# EAGLE design sub (EAGLE 7.7.0)
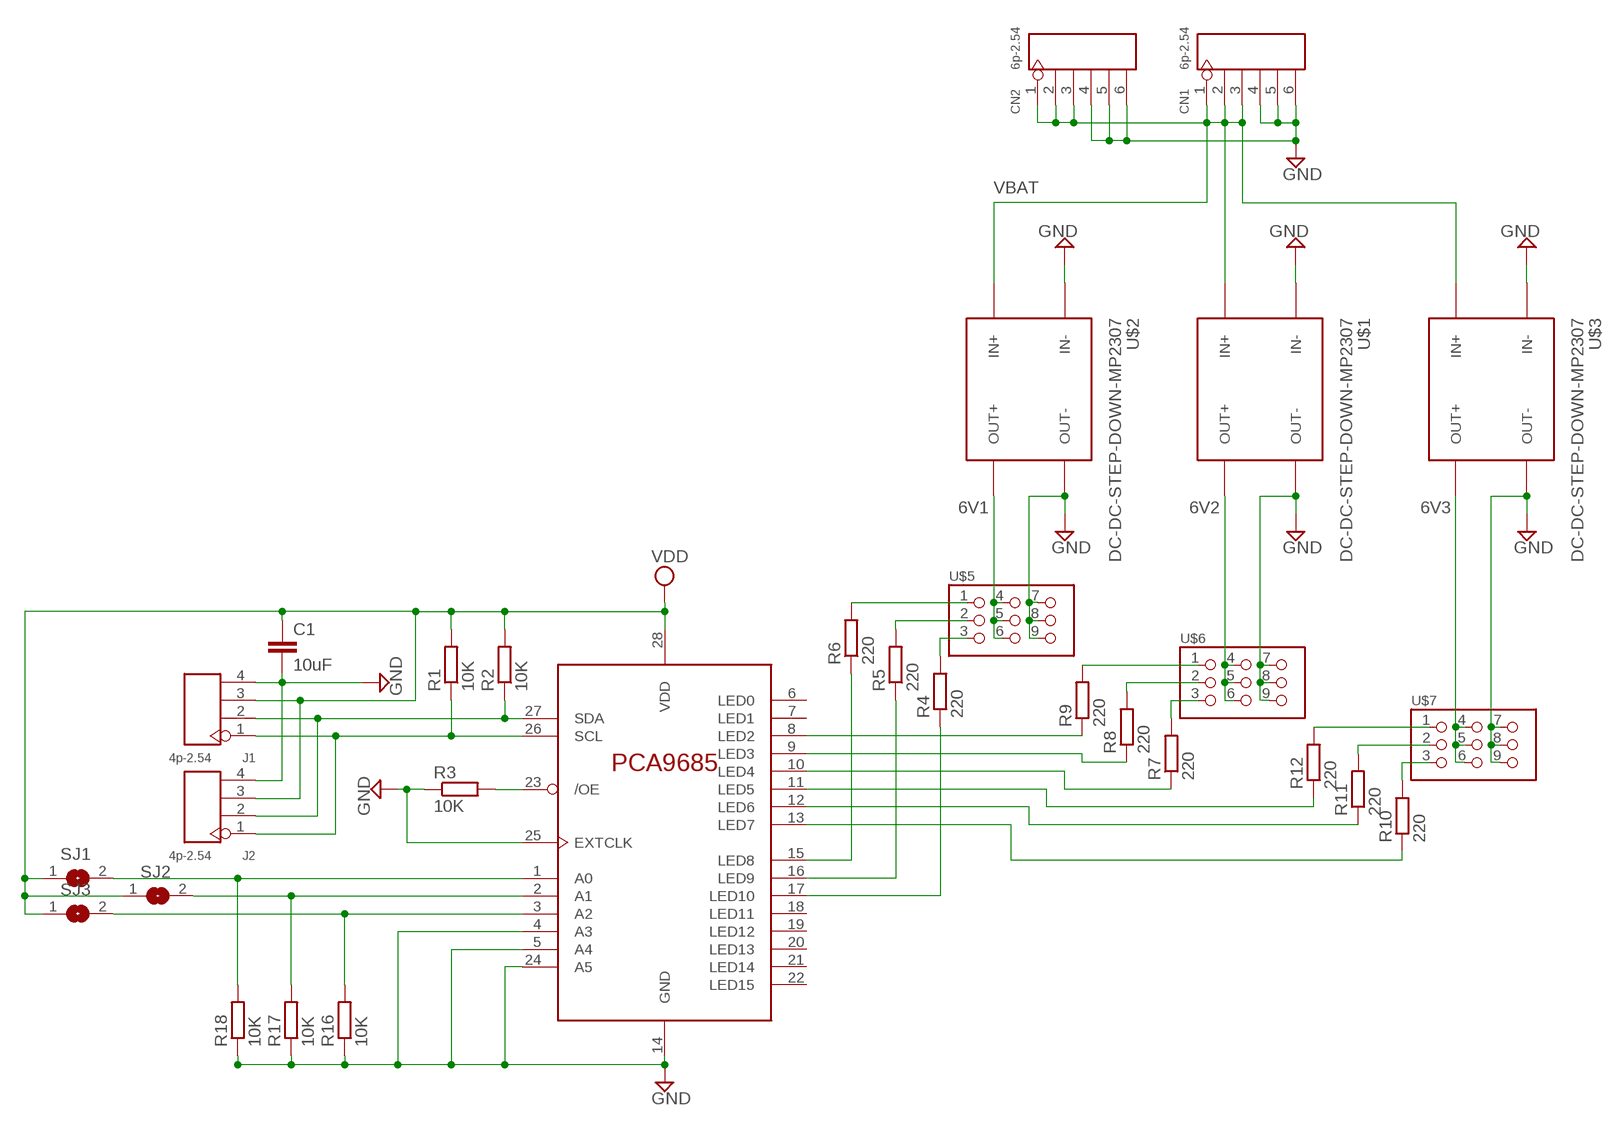
[diagram p0: schematic, sheet 1]

## Parts
C1  10uF  C-EUC0805  [C0805]
CN1  6p-2.54  DIP-BLACK-FEMALE-HEADER-VERT(6P-2.54)  [H6-2.54]
CN2  6p-2.54  DIP-BLACK-FEMALE-HEADER-VERT(6P-2.54)  [H6-2.54]
J1  4p-2.54  DIP-BLACK-FEMALE-HEADER-VERT(4P-2.54)  [H4-2.54]
J2  4p-2.54  DIP-BLACK-FEMALE-HEADER-VERT(4P-2.54)  [H4-2.54]
R1  10K  R-EU_M0805  [M0805]
R2  10K  R-EU_M0805  [M0805]
R3  10K  R-EU_M0805  [M0805]
R4  220  R-EU_M0805  [M0805]
R5  220  R-EU_M0805  [M0805]
R6  220  R-EU_M0805  [M0805]
R7  220  R-EU_M0805  [M0805]
R8  220  R-EU_M0805  [M0805]
R9  220  R-EU_M0805  [M0805]
R10  220  R-EU_M0805  [M0805]
R11  220  R-EU_M0805  [M0805]
R12  220  R-EU_M0805  [M0805]
R16  10K  R-EU_M0805  [M0805]
R17  10K  R-EU_M0805  [M0805]
R18  10K  R-EU_M0805  [M0805]
SJ1  SJ  [SJ]
SJ2  SJ  [SJ]
SJ3  SJ  [SJ]
U$1  DC-DC-STEP-DOWN-MP2307  [DC-DC-STEP-DOWN-MP2307]
U$2  DC-DC-STEP-DOWN-MP2307  [DC-DC-STEP-DOWN-MP2307]
U$3  DC-DC-STEP-DOWN-MP2307  [DC-DC-STEP-DOWN-MP2307]
U$4  PCA9685PW  [TSSOP28]
U$5  PIN_3X3  [PIN_3X3]
U$6  PIN_3X3  [PIN_3X3]
U$7  PIN_3X3  [PIN_3X3]

## Nets
6V1 [6v]: U$2.OUT+ U$5.4 U$5.5 U$5.6
6V2 [6v]: U$1.OUT+ U$6.4 U$6.5 U$6.6
6V3 [6v]: U$3.OUT+ U$7.4 U$7.5 U$7.6
GND: C1.2 CN1.4 CN1.5 CN1.6 CN2.4 CN2.5 CN2.6 J1.4 J2.4 R3.1 R16.1 R17.1 R18.1 U$1.IN- U$1.OUT- U$2.IN- U$2.OUT- U$3.IN- U$3.OUT- U$4.4(A3) U$4.5(A4) U$4.14(GND) U$4.24(A5) U$4.25(EXTCLK) U$5.7 U$5.8 U$5.9 U$6.7 U$6.8 U$6.9 U$7.7 U$7.8 U$7.9
N$2: J1.1 J2.1 R1.1 U$4.26(SCL)
N$4: R6.1 U$4.15(LED8)
N$5: R3.2 U$4.23(/OE)
N$6: R5.1 U$4.16(LED9)
N$7: R4.1 U$4.17(LED10)
N$8: R9.1 U$4.8(LED2)
N$9: R8.1 U$4.9(LED3)
N$10: R7.1 U$4.10(LED4)
N$11: R11.1 U$4.12(LED6)
N$12: R4.2 U$5.3
N$13: R5.2 U$5.2
N$14: R6.2 U$5.1
N$18: R9.2 U$6.1
N$19: R8.2 U$6.2
N$20: R7.2 U$6.3
N$21: R10.1 U$4.13(LED7)
N$23: R12.1 U$4.11(LED5)
N$24: R12.2 U$7.1
N$25: R11.2 U$7.2
N$26: R10.2 U$7.3
N$30: R16.2 SJ3.2 U$4.3(A2)
N$31: R17.2 SJ2.2 U$4.2(A1)
N$32: R18.2 SJ1.2 U$4.1(A0)
N$34: J1.2 J2.2 R2.1 U$4.27(SDA)
VBAT [raw]: CN1.1 CN1.2 CN1.3 CN2.1 CN2.2 CN2.3 U$1.IN+ U$2.IN+ U$3.IN+
VDD: C1.1 J1.3 J2.3 R1.2 R2.2 SJ1.1 SJ2.1 SJ3.1 U$4.28(VDD)
Unconnected: U$4.6(LED0) U$4.7(LED1) U$4.18(LED11) U$4.19(LED12) U$4.20(LED13) U$4.21(LED14) U$4.22(LED15)

## Library data of the parts
C1 = resistor:C-EU: CAPACITOR, European symbol
CN1 CN2 = Seeed-Connector -2016:DIP-BLACK-FEMALE-HEADER-VERT(6P-2.54): 320030060; MPN: F185-1106A1BSYC1
J1 J2 = Seeed-Connector -2016:DIP-BLACK-FEMALE-HEADER-VERT(4P-2.54): 320030017; MPN: F185-1104A1BSYA1
R1-R12 R16-R18 = resistor:R-EU_: RESISTOR, European symbol
SJ1-SJ3 = jumper:SJ: SMD solder JUMPER
U$1-U$3 = diy-modules:DC-DC-STEP-DOWN-MP2307: DC/DC Step-Down Regulator based on MP2307DN chip MP2307 datasheet available here: https://cdn-shop.adafruit.com/datasheets/MP2307_r1.9.pdf Click here to find device on ebay.com <http://www.ebay.com/sch/dc+dc+3a+mini+converter>
U$4 = i2c-led-controller:PCA9685
U$5-U$7 = pinhead_3row:PIN_3X3

## Net classes
1 raw: width 2.54 mm
2 6v: width 1.372 mm

## Board
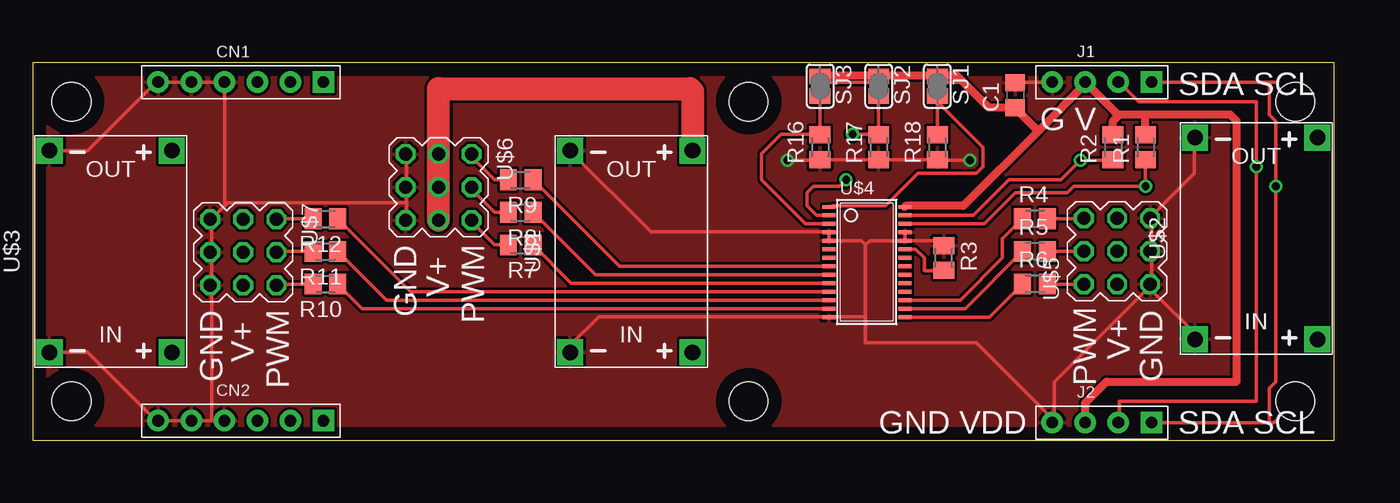
[diagram p1: board, top side]
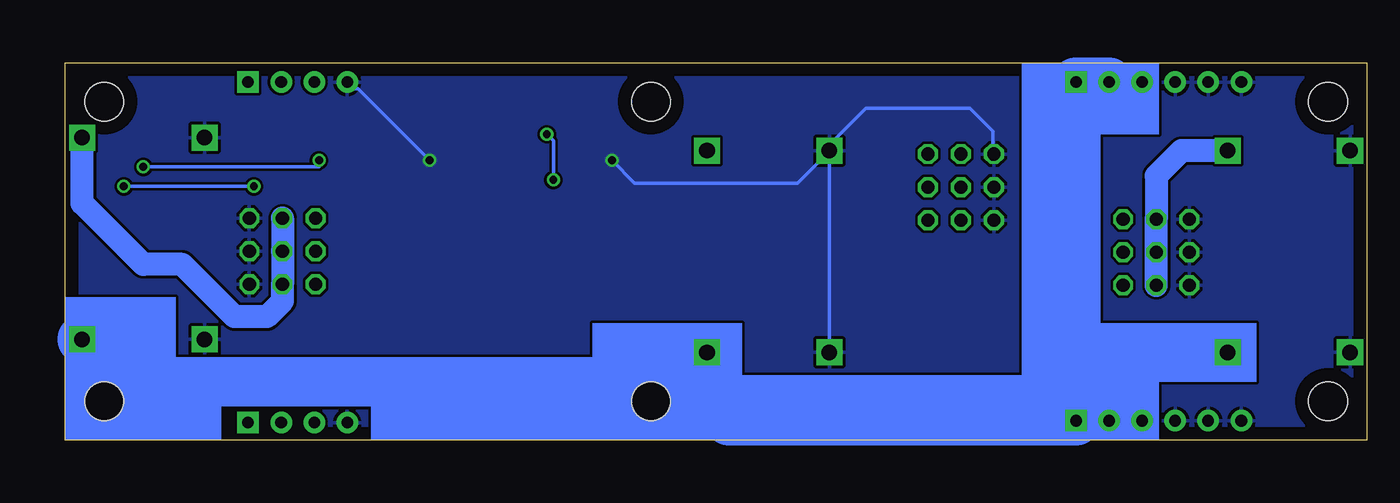
[diagram p2: board, bottom side, seen from below]

Size 100 x 29 mm. Coordinates in mm from the lower left corner, seen from the top.
Outline: 0,0 100,0 100,29 0,29 0,0
Copper layers (1*16): Top 0.035mm / dielectric 1.5mm / Bottom 0.035mm
Design rules "default": minimum track width 10mil, minimum drill 24mil, track to track 8mil, track to pad 8mil, pad to pad 8mil, via to via 8mil, smd to smd 8mil, copper to edge 40mil, drill to drill 8mil, minimum pad ring 10mil, minimum via ring 8mil, stop-mask expansion 4mil, vias tented up to drill 0mil, thermal gap 10mil
Holes 3 mm at 3,26 3,3 97,26 97,3 55,3 55,26

### Footprints (pad centres in the part's own frame; a part is rotated, then mirrored left to right if it is on the bottom)
C0805 = smd 1.3 x 1.5: 1 -0.95,0; 2 0.95,0
H6-2.54 = drill 0.889 pad 1.651 square: 1 0,6.35 | drill 0.889 pad 1.651: 2 0,3.81; 3 0,1.27; 4 0,-1.27; 5 0,-3.81; 6 0,-6.35
H4-2.54 = drill 0.889 pad 1.651 square: 1 0,3.81 | drill 0.889 pad 1.651: 2 0,1.27; 3 0,-1.27; 4 0,-3.81
M0805 = smd 1.3 x 1.6: 1 -0.95,0; 2 0.95,0
SJ = smd 1.168 x 1.6: 1 -0.762,0; 2 0.762,0
DC-DC-STEP-DOWN-MP2307 = drill 1.2 pad 2 square: IN+ -7.747,-4.699; IN- -7.747,4.699; OUT+ 7.747,-4.699; OUT- 7.747,4.699
TSSOP28 = smd 0.305 x 0.991: 1 -4.225,-2.918; 2 -3.575,-2.918; 3 -2.925,-2.918; 4 -2.275,-2.918; 5 -1.625,-2.918; 6 -0.975,-2.918; 7 -0.325,-2.918; 8 0.325,-2.918; 9 0.975,-2.918; 10 1.625,-2.918; 11 2.275,-2.918; 12 2.925,-2.918; 13 3.575,-2.918; 14 4.225,-2.918; 15 4.225,2.918; 16 3.575,2.918; 17 2.925,2.918; 18 2.275,2.918; 19 1.625,2.918; 20 0.975,2.918; 21 0.325,2.918; 22 -0.325,2.918; 23 -0.975,2.918; 24 -1.625,2.918; 25 -2.275,2.918; 26 -2.925,2.918; 27 -3.575,2.918; 28 -4.225,2.918
PIN_3X3 = drill 1.016 octagon: 1 1.27,-1.27; 2 3.81,-1.27; 3 6.35,-1.27; 4 1.27,-3.81; 5 3.81,-3.81; 6 6.35,-3.81; 7 1.27,-6.35; 8 3.81,-6.35; 9 6.35,-6.35

### Placement (x,y rotation side)
C1  75.5,26.5 90 top
CN1  16,27.5 270 top
CN2  16,1.5 270 top
J1  82.14,27.51 270 top
J2  82.14,1.36 270 top
R1  85.5,22.5 90 top
R2  83,22.5 90 top
R3  70,14 270 top
R4  77,17 0 top
R5  77,14.5 0 top
R6  77,12 0 top
R7  37.5,15 180 top
R8  37.5,17.5 180 top
R9  37.5,20 180 top
R10  22.5,12 180 top
R11  22.5,14.5 180 top
R12  22.5,17 180 top
R16  60.5,22.5 90 top
R17  65,22.5 90 top
R18  69.5,22.5 90 top
SJ1  69.5,27.2 270 top
SJ2  65,27.2 270 top
SJ3  60.5,27.2 270 top
U$1  46,14.5 90 top
U$2  94,15.5 90 top
U$3  6,14.5 90 top
U$4  64.09,13.69 270 top
U$5  79.5,10.71 90 top
U$6  35,23.25 270 top
U$7  20,18.25 270 top

### Tracks (layer width: path | path; a pad name or v marks a point on that pad's centre or on a via)
6V1
  Bottom 1.778: U$5.6 U$5.5 U$5.4 83.31,10.69 84.5,9.5 87,9.5 91,13.5 94,13.5 98.7,18.2 U$2.OUT+
6V2
  Top 1.778: U$6.6 U$6.5 U$6.4 31.19,27 50.5,27 50.7,26.8 U$1.OUT+
6V3
  Bottom 1.778: U$7.6 U$7.5 U$7.4 16.19,20.31 14.25,22.25 U$3.OUT+
GND  (via drill 0.6)
  Top 0.254: U$2.OUT- 89.25,22 89.25,20.5 86,17.25 U$5.9 86,17 86,14.75 U$5.8 86,14.5 86,12 U$5.7 | U$3.OUT- 1.5,22.25 4.25,22.25 9.5,27.5 CN1.6 CN1.5 CN1.4 14.75,27.5 14.75,18 | 28.75,18.25 28.75,19.25 U$6.8 28.75,19.5 v28.75,21.75 U$6.7 | 28.75,18.25 28.75,17 U$6.9 | 13.75,1.5 CN2.5 CN2.6 9.5,1.5 4.25,6.75 1.5,6.75 U$3.IN- | 13.75,1.5 CN2.4 | 13.75,1.5 13.75,11.75 U$7.9 13.75,12 13.75,14.25 U$7.8 13.75,14.5 13.75,16.75 U$7.7 13.75,17 14.75,18 | 28.75,18.25 15,18.25 14.75,18 | R3.1 69.64,15.31 U$4.24 | U$1.OUT- 41.3,22.2 47.5,16 61.14,16 U$4.4 U$4.5 63.69,15.31 64,15 | U$5.7 86,11.5 89.5,8 U$2.IN- | U$5.7 85.5,11.5 78.5,4.5 78.5,1.53 J2.4 | U$4.14 61.14,9.5 | 61.14,9.5 43.5,9.5 41.3,7.3 U$1.IN- | 61.14,9.5 64,9.5 | 64,9.5 64,15 | 64,15 64.31,15.31 U$4.24 | v58,21.5 60.45,21.5 R16.1 R17.1 R18.1 69.55,21.5 v72,21.5 | 78.5,1.5 72.5,7.5 64,7.5 64,9.5 | J1.4 75.56,27.51 C1.2 | U$4.24 U$4.25
  Bottom 0.254: v28.75,21.75 28.75,23.75 30.5,25.5 38.5,25.5 41.3,22.7 U$1.OUT- | U$1.OUT- U$1.IN- | v58,21.5 56.25,19.75 43.75,19.75 41.3,22.2 U$1.OUT- | v72,21.5 77.5,27 78.52,27
  pour Bottom: 0,29 0,0 100,0 100,29
  pour Top: 0,29 0,0 100,0 100,29
N$2  (via drill 0.6)
  Top 0.254: J2.1 95,1.36 | 95,1.36 95.36,1.36 95.5,1.5 | R1.1 v85.5,19.5 80,19.5 79.5,19 75.5,19 73.11,16.61 U$4.26 | J1.1 95,27.51 | 95,27.51 95.49,27.51 95.5,27.5 | 95,27.51 95,25 95.5,24.5 v95.5,19.5 95.5,4.5 95,4 95,1.36
  Bottom 0.254: v95.5,19.5 v85.5,19.5
N$4
  Top 0.254: R6.1 73.52,9.46 U$4.15
N$5
  Top 0.254: R3.2 69.95,13 68.5,13 68.5,14 67.83,14.66 U$4.23
N$6
  Top 0.254: R5.1 71.67,10.12 U$4.16
N$7
  Top 0.254: R4.1 74.55,15.5 74.5,15.5 74.5,14 71.27,10.77 U$4.17
N$8
  Top 0.254: R9.1 45.09,13.37 U$4.8
N$9
  Top 0.254: R8.1 43.23,12.71 U$4.9
N$10
  Top 0.254: R7.1 41.38,12.06 U$4.10
N$11
  Top 0.254: R11.1 27.18,10.77 U$4.12
N$12
  Top 0.254: R4.2 80.75,17 U$5.3
N$13
  Top 0.254: R5.2 80.75,14.5 U$5.2
N$14
  Top 0.254: R6.2 80.75,12 U$5.1
N$18
  Top 0.254: R9.2 35.5,20 33.75,21.75 | 33.75,21.75 | 33.75,21.75 33.83,21.83 33.83,21.95 U$6.1
N$19
  Top 0.254: R8.2 35.5,17.5 33.75,19.25 U$6.2
N$20
  Top 0.254: R7.2 35.5,15 33.75,16.75 U$6.3
N$21
  Top 0.254: R10.1 25.34,10.12 U$4.13
N$23
  Top 0.254: R12.1 29.04,11.41 U$4.11
N$24
  Top 0.254: R12.2 18.75,17 U$7.1
N$25
  Top 0.254: R11.2 18.75,14.5 U$7.2
N$26
  Top 0.254: R10.2 18.75,12 U$7.3
N$30
  Top 0.254: SJ3.2 R16.2 60.45,23.5 57.5,23.5 56,22 56,20 59.38,16.61 U$4.3
N$31  (via drill 0.6)
  Top 0.254: SJ2.2 R17.2 64.95,23.5 v63,23.5 | v62.5,20 62,19.5 60,19.5 59.5,19 59.5,18 60.23,17.27 U$4.2
  Bottom 0.254: v63,23.5 62.5,23 v62.5,20
N$32
  Top 0.254: 69.5,26 73,22.5 73,21 72.5,20.5 68,20.5 65.5,18 61.5,18 U$4.1 | 69.5,26 R18.2 | 69.5,26 SJ1.2
N$34  (via drill 0.6)
  Top 0.254: J2.2 83.5,1.45 83.5,3 94,3 v94,21 94,26 85,26 83.49,27.51 J1.2 | R2.1 83,21.5 v80.5,21.5 79,20 75,20 72.27,17.27 U$4.27
  Bottom 0.254: v94,21 80.5,21 v80.5,21.5
VBAT
  Bottom 2.54: CN2.1 CN2.2 CN2.3 | CN1.2 CN1.3
  Bottom 3.81: U$2.IN+ 95.45,4.5 52,4.5 | 52,4.5 49,1.5 CN2.1 22.35,6.75 | 52,4.5 50.7,5.8 U$1.IN+ | U$3.IN+ 22.35,6.75 | 22.35,6.75 CN1.1 CN1.2
VDD
  Top 0.254: SJ2.1 65,27.5 60.5,27.5 SJ3.1 | 71.5,27.5 69.5,27.5 SJ1.1
  Top 0.61: J2.3 80.87,2.87 82.5,4.5 92.5,4.5 92.5,24.5 92,25 85.5,25 | 85.5,25 83.5,25 | 83.5,25 83.38,25 J1.3 80.87,27.37 77.25,23.75 | R1.2 85.5,25 | R2.2 83,24.5 83.5,25 | 77.25,23.75 71.5,18 67.09,18 U$4.28 | 77.25,23.75 75.5,25.5 C1.1 73.45,25.55 71.5,27.5 71,28 60.54,28 SJ3.1
(copper drawn outside any net)
  shapes: Bottom area x16

### Text on the board
tPlace: SDA SCL | G V | V+ | GND | PWM | V+ | V+ | GND | PWM | PWM | GND | GND VDD | SDA SCL